# EAGLE design BSB_ESP (EAGLE 9.6.2)
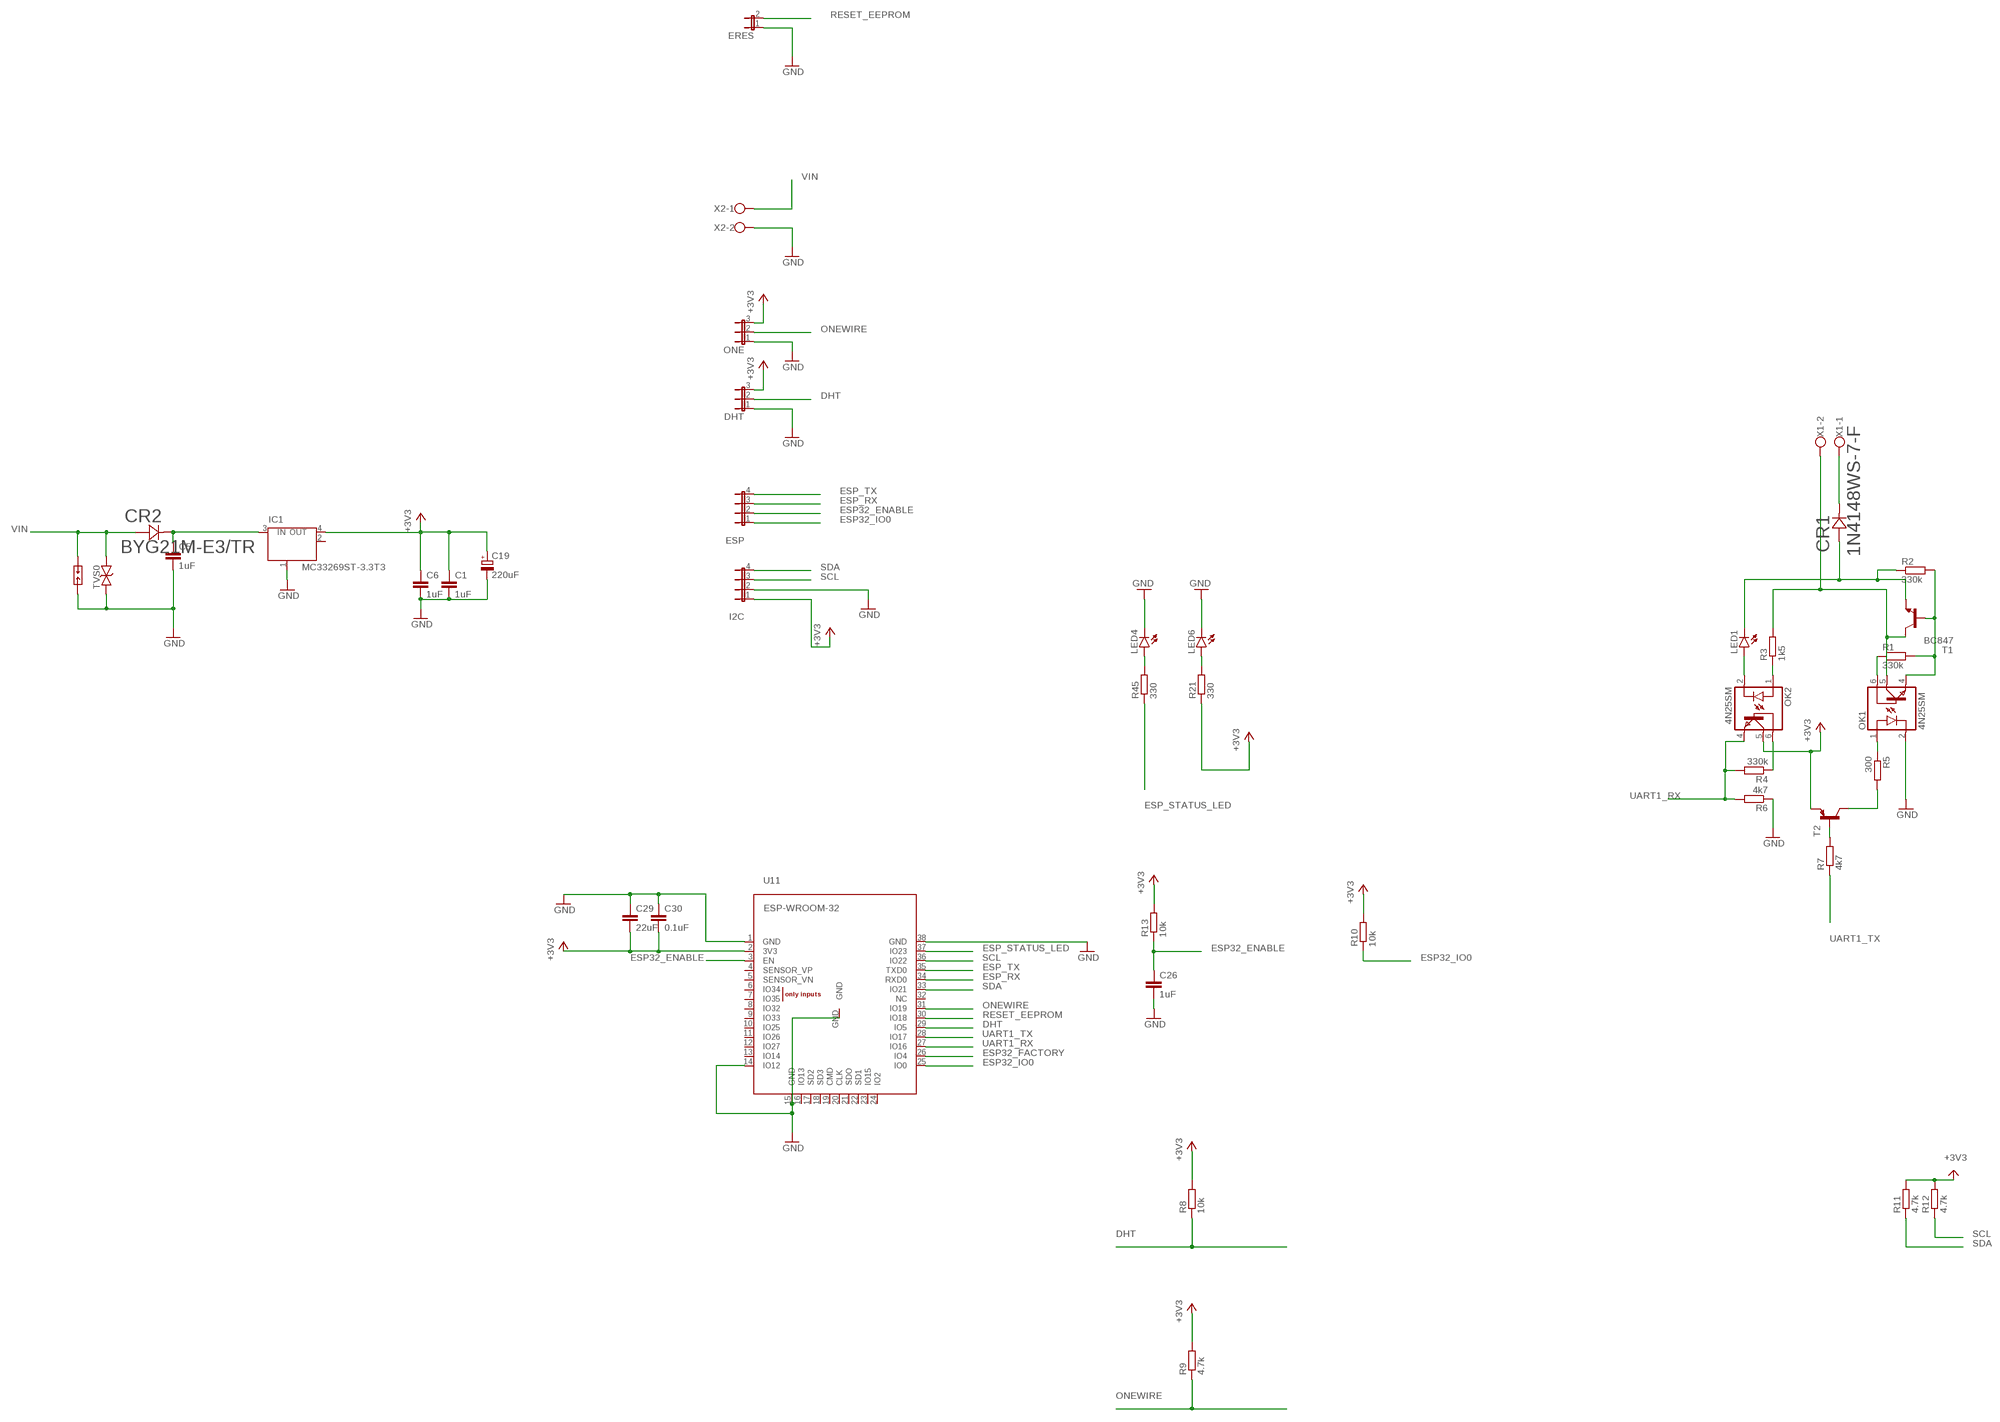
[diagram p0: schematic, sheet 1]

## Parts
C1  1uF  C-EUC1210  [C1210]
C5  1uF  C-EUC0805  [C0805]
C6  1uF  C-EUC0805  [C0805]
C19  220uF  CPOL-EU153CLV-0807  [153CLV-0807]
C26  1uF  C-EUC0603  [C0603]
C29  22uF  C-EUC0805  [C0805]
C30  0.1uF  C-EUC0805  [C0805]
CR1  1N4148WS-7-F  [SOD323_DIO]
CR2  BYG21M-E3/TR  [DO-214AC_VIS]
DHT  JP2E  [JP2]
ERES  JP1E  [JP1]
ESP  JP4E  [JP4]
I2C  JP4E  [JP4]
IC1  MC33269ST-3.3T3  [SOT223]
LED1  LEDCHIP-LED0805  [CHIP-LED0805]
LED4  LEDCHIP-LED0805  [CHIP-LED0805]
LED6  LEDCHIP-LED0805  [CHIP-LED0805]
OK1  4N25SM  [DIL6-SMD]
OK2  4N25SM  [DIL6-SMD]
ONE  JP2E  [JP2]
R1  330k  R-EU_R0603  [R0603]
R2  330k  R-EU_R0603  [R0603]
R3  1k5  R-EU_R0603  [R0603]
R4  330k  R-EU_R0603  [R0603]
R5  300  R-EU_R0603  [R0603]
R6  4k7  R-EU_R0603  [R0603]
R7  4k7  R-EU_R0603  [R0603]
R8  10k  R-EU_R0402  [R0402]
R9  4.7k  R-EU_R0402  [R0402]
R10  10k  R-EU_R0603  [R0603]
R11  4.7k  R-EU_R0603  [R0603]
R12  4.7k  R-EU_R0603  [R0603]
R13  10k  R-EU_R0603  [R0603]
R21  330  R-EU_R0603  [R0603]
R45  330  R-EU_R0603  [R0603]
SP0  PCB-SGAP  [PCB-SGAP]
T1  BC847  [SOT23]
T2  BC857A-PNP-SOT23-BEC  [SOT23-BEC]
TVS0  43CA  DIODE-BTVSSMB  [SMB]
U11  ESP-WROOM-32  [ESP-WROOM-32]
X1  W237-102  [W237-102]
X2  W237-102  [W237-102]

## Nets
+3V3 [3v]: C1.1 C6.1 C19.+ C29.2 C30.2 DHT.3 I2C.1 IC1.4(OUT) OK2.5(COL) ONE.3 R8.2 R9.2 R10.2 R11.2 R12.2 R13.2 R21.1 T2.E U11.2(3V3) ; supply symbol labelled 3.3V
DHT: DHT.2 R8.1 U11.29(IO5)
ESP32_ENABLE: C26.1 ESP.2 R13.1 U11.3(EN)
ESP32_FACTORY: U11.26(IO4)
ESP32_IO0: ESP.1 R10.1 U11.25(IO0)
ESP_RX: ESP.3 U11.34(RXD0)
ESP_STATUS_LED: R45.1 U11.37(IO23)
ESP_TX: ESP.4 U11.35(TXD0)
GND [GND]: C1.2 C5.2 C6.2 C19.- C26.2 C29.1 C30.1 DHT.1 ERES.1 I2C.2 IC1.1(GND/ADJ) LED4.C LED6.C OK1.2(C) ONE.1 R6.1 SP0.2 TVS0.A U11.1(GND) U11.14(IO12) U11.15(GND) U11.38(GND) U11.GND X2.2
N$1: CR1.1 X1.1
N$2: OK2.1(A) R3.1
N$3: LED1.A OK2.2(C)
N$4: OK1.5(COL) R3.2 T1.3(C) X1.2
N$5: OK1.6(BAS) R1.1
N$6: OK1.4(EMI) R1.2 R2.2 T1.1(B)
N$7: CR1.2 LED1.C R2.1 T1.2(E)
N$8: OK2.6(BAS) R4.1
N$9: R7.2 T2.B
N$10: OK1.1(A) R5.1
N$11: R5.2 T2.C
N$35: LED4.A R45.2
N$39: LED6.A R21.2
ONEWIRE: ONE.2 R9.1 U11.31(IO19)
RESET_EEPROM: ERES.2 U11.30(IO18)
SCL: I2C.3 R12.1 U11.36(IO22)
SDA: I2C.4 R11.1 U11.33(IO21)
UART1_RX: OK2.4(EMI) R4.2 R6.2 U11.27(IO16)
UART1_TX: R7.1 U11.28(IO17)
VIN: CR2.2 SP0.1 TVS0.C X2.1
VIN_POS: C5.1 CR2.1 IC1.3(IN)
Unconnected: IC1.2(OUT) U11.4(SENSOR_VP) U11.5(SENSOR_VN) U11.6(IO34) U11.7(IO35) U11.8(IO32) U11.9(IO33) U11.10(IO25) U11.11(IO26) U11.12(IO27) U11.13(IO14) U11.16(IO13) U11.17(SD2) U11.18(SD3) U11.19(CMD) U11.20(CLK) U11.21(SDO) U11.22(SD1) U11.23(IO15) U11.24(IO2) U11.32(NC)

## Library data of the parts
C1 C5 C6 C26 C29 C30 = rcl:C-EU: CAPACITOR, European symbol; SPICEPREFIX: C
C19 = rcl:CPOL-EU: POLARIZED CAPACITOR, European symbol; SPICEPREFIX: C
CR1 = 1N4148WS:1N4148WS-7-F; COPYRIGHT: Copyright (C) 2021 Ultra Librarian. All rights reserved.; MANUFACTURER_PART_NUMBER: 1N4148WS-7-F; MFR_NAME: Diodes Inc
CR2 = BYG21M_E3:BYG21M-E3/TR; COPYRIGHT: Copyright (C) 2021 Ultra Librarian. All rights reserved.; MANUFACTURER_PART_NUMBER: BYG21M-E3/TR; MFR_NAME: Vishay
DHT ONE = jumper:JP2E: JUMPER
ERES = jumper:JP1E: JUMPER
ESP I2C = jumper:JP4E: JUMPER
IC1 = linear:MC33269ST*: Adjustable Output Low Dropout Voltage Regulator 800 mA Source: http://www.onsemi.com/pub/Collateral/MC33269-D.PDF
LED1 LED4 LED6 = led:LED: LED OSRAM: - CHIPLED LG R971, LG N971, LY N971, LG Q971, LY Q971, LO R971, LY R971 LH N974, LH R974 LS Q976, LO Q976, LY Q976 LO Q996 - Hyper CHIPLED LW Q18S LB Q993, LB Q99A, LB R99A - SideLED LS A670, LO A670, LY A670, LG A670, LP A670 LB A673, LV A673, LT A673, LW A673 LH A674 LY A675 LS A676, LA A676, LO A676, LY A676, LW A676 LS A679, LY A679, LG A679 - Hyper Micro SIDELED® LS Y876, LA Y876, LO Y876, LY Y876 LT Y87S - SmartLED LW L88C, LW L88S LB L89C, LB L89S, LG L890 LS L89K, LO L89K, LY L89K LS L896, LA L896, LO L896, LY L896 - TOPLED LS T670, LO T670, LY T670, LG T670, LP T670 LSG T670, LSP T670, LSY T670, LOP T670, LYG T670 LG T671, LOG T671, LSG T671 LB T673, LV T673, LT T673, LW T673 LH T674 LS T676, LA T676, LO T676, LY T676, LB T676, LH T676, LSB T676, LW T676 LB T67C, LV T67C, LT T67C, LS T67K, LO T67K, LY T67K, LW E67C LS E67B, LA E67B, LO E67B, LY E67B, LB E67C, LV E67C, LT E67C LW T67C LS T679, LY T679, LG T679 LS T770, LO T770, LY T770, LG T770, LP T770 LB T773, LV T773, LT T773, LW T773 LH T774 LS E675, LA E675, LY E675, LS T675 LS T776, LA T776, LO T776, LY T776, LB T776 LHGB T686 LT T68C, LB T68C - Hyper Mini TOPLED® LB M676 - Mini TOPLED Santana® LG M470 LS M47K, LO M47K, LY M47K Source: http://www.osram.convergy.de LUXEON: - LUMILED® LXK2-PW12-R00, LXK2-PW12-S00, LXK2-PW14-U00, LXK2-PW14-V00 LXK2-PM12-R00, LXK2-PM12-S00, LXK2-PM14-U00 LXK2-PE12-Q00, LXK2-PE12-R00, LXK2-PE12-S00, LXK2-PE14-T00, LXK2-PE14-U00 LXK2-PB12-K00, LXK2-PB12-L00, LXK2-PB12-M00, LXK2-PB14-N00, LXK2-PB14-P00, LXK2-PB14-Q00 LXK2-PR12-L00, LXK2-PR12-M00, LXK2-PR14-Q00, LXK2-PR14-R00 LXK2-PD12-Q00, LXK2-PD12-R00, LXK2-PD12-S00 LXK2-PH12-R00, LXK2-PH12-S00 LXK2-PL12-P00, LXK2-PL12-Q00, LXK2-PL12-R00 Source: www.luxeon.com KINGBRIGHT: KA-3528ASYC Source: www.kingbright.com
OK1 OK2 = optocoupler:4N*?M: General Purpose 6-Pin Phototransistor Optocouplers Source: http://www.fairchildsemi.com/ds/4N/4N35-M.pdf; MF: FAIRCHILD SEMICONDUCTOR; MPN: 4N25SM; OC_FARNELL: 1021152; OC_NEWARK: 34C2020
R1-R13 R21 R45 = rcl:R-EU_: RESISTOR, European symbol; SPICEPREFIX: R
SP0 = varistor:PCB-SGAP
T1 = transistor:BC847: NPN TRANSISTOR
T2 = transistor:*-PNP-: PNP Transistror
TVS0 = diode:DIODE-BTVS
U11 = esp32b:ESP-WROOM-32
X1 X2 = con-wago-500:W237-102: WAGO SCREW CLAMP; MPN: 237-102; OC_FARNELL: unknown; OC_NEWARK: 70K9898

## Net classes
0 default: width 0.305 mm
4 3v: width 0.508 mm
8 GND: width 0.508 mm

## Board
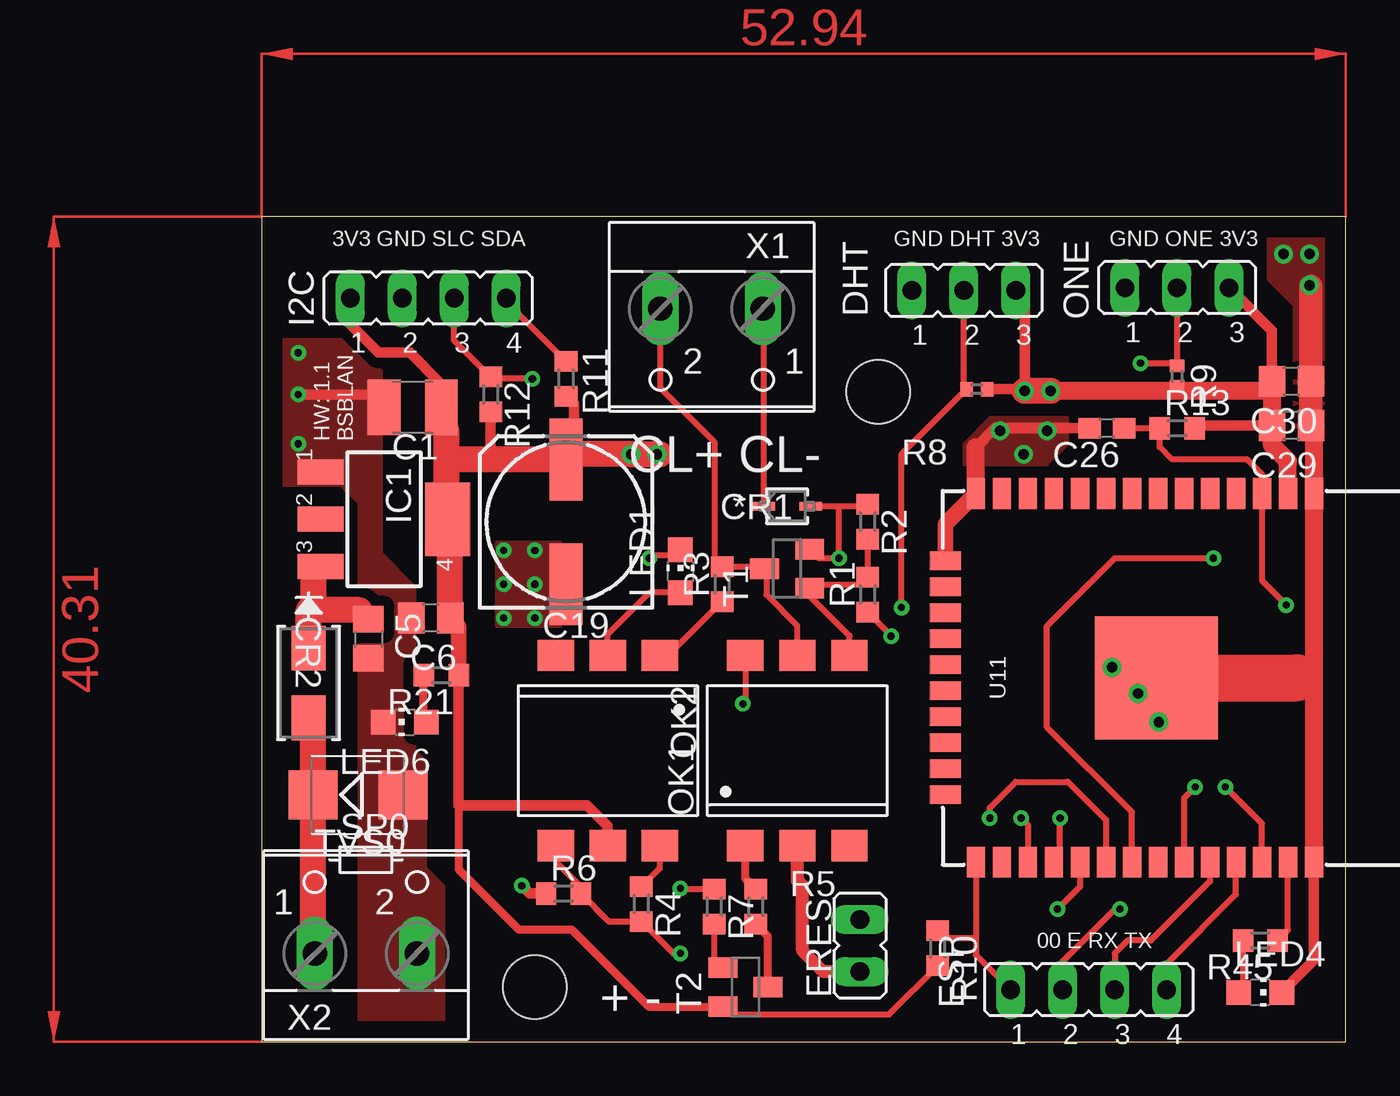
[diagram p1: board, top side]
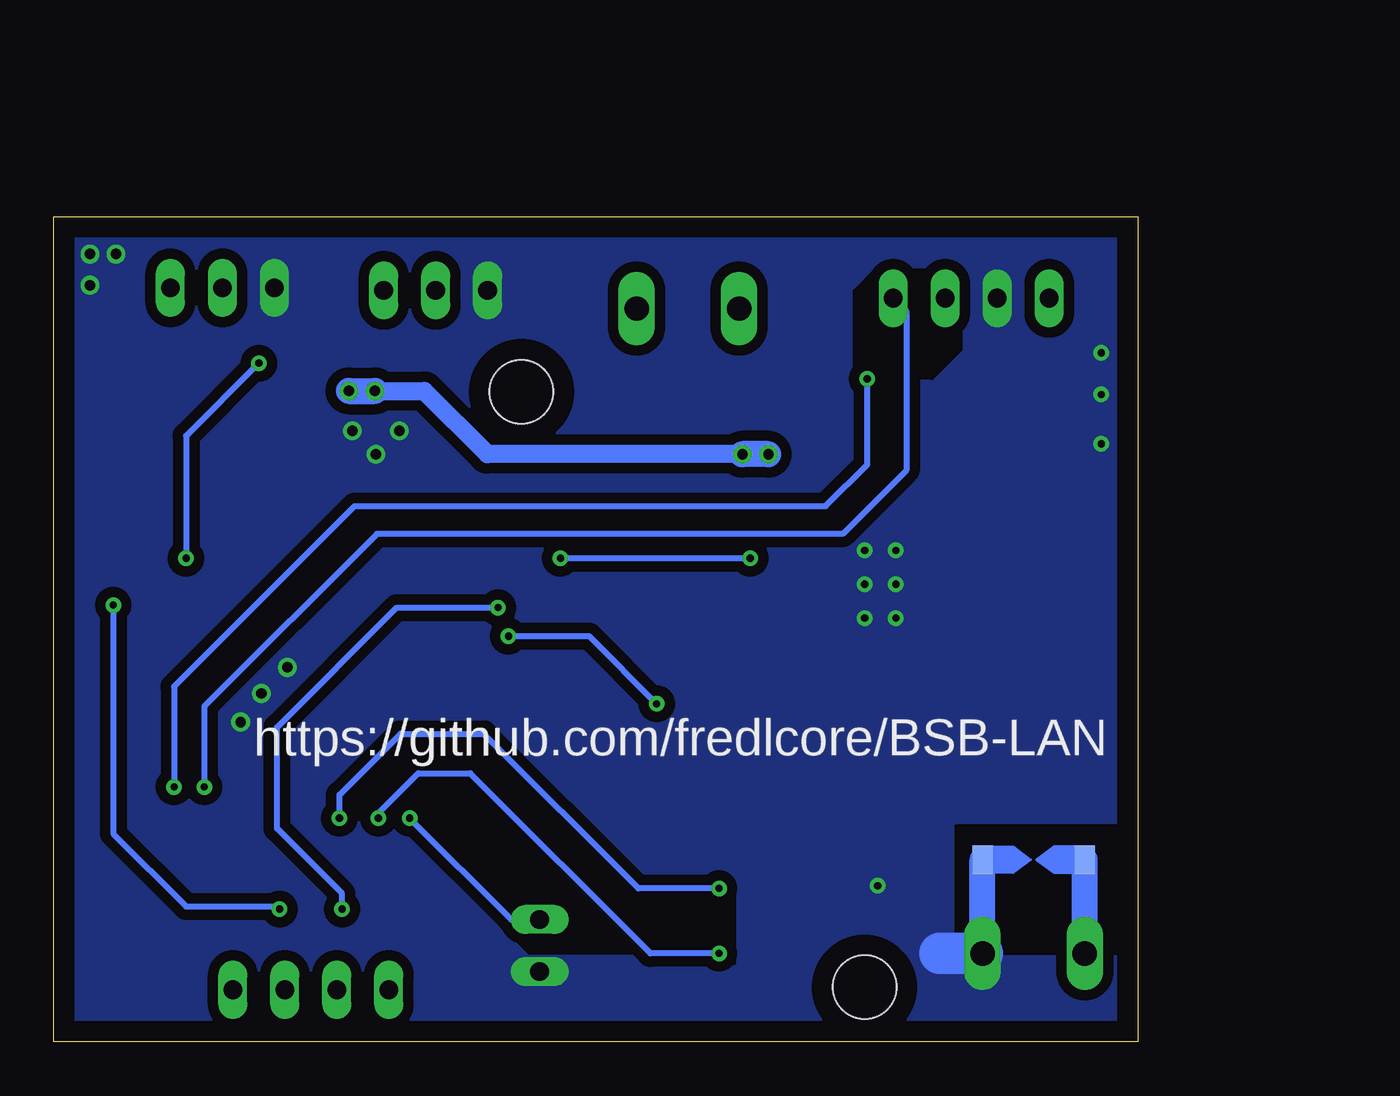
[diagram p2: board, bottom side, seen from below]

Size 52.94 x 40.31 mm. Coordinates in mm from the lower left corner, seen from the top.
Outline: 0,0 52.94,0 52.94,40.31 0,40.31 0,0
Copper layers (1*16): Top 0.035mm / dielectric 1.5mm / Bottom 0.035mm
Design rules "default": minimum track width 6mil, minimum drill 0.35mm, track to track 6mil, track to pad 6mil, pad to pad 6mil, via to via 6mil, smd to smd 6mil, copper to edge 40mil, drill to drill 6mil, minimum pad ring 10mil, minimum via ring 8mil, stop-mask expansion 4mil, vias tented up to drill 0mil, thermal gap 10mil
Holes 3.1 mm at 30.1,31.75 13.34,2.67

### Footprints (pad centres in the part's own frame; a part is rotated, then mirrored left to right if it is on the bottom)
C1210 = smd 1.6 x 2.7: 1 -1.4,0; 2 1.4,0
C0805 = smd 1.3 x 1.5: 1 -0.95,0; 2 0.95,0
153CLV-0807 = smd 4 x 1.6: + 3.05,0; - -3.05,0
C0603 = smd 1.1 x 1: 1 -0.85,0; 2 0.85,0
SOD323_DIO = smd 1.111 x 0.401: 1 -1.15,0; 2 1.15,0
DO-214AC_VIS = smd 2.184 x 1.651: 1 -1.702,0; 2 1.702,0
JP2 = drill 0.914 long: 1 -2.54,0; 2 0,0; 3 2.54,0
JP1 = drill 0.914 long: 1 0,-1.27; 2 0,1.27
JP4 = drill 0.914 long: 1 -3.81,0; 2 -1.27,0; 3 1.27,0; 4 3.81,0
SOT223 = smd 1.219 x 2.235: 1 -2.311,-3.099; 2 0,-3.099; 3 2.311,-3.099 | smd 3.6 x 2.2: 4 0,3.099
CHIP-LED0805 = smd 1.2 x 1.2: A 0,-1.05; C 0,1.05
DIL6-SMD = smd 1.78 x 1.52: 1 -2.54,-4.645; 2 0,-4.645; 3 2.54,-4.645; 4 2.54,4.645; 5 0,4.645; 6 -2.54,4.645
R0603 = smd 1 x 1.1: 1 -0.85,0; 2 0.85,0
R0402 = smd 0.6 x 0.7: 1 -0.5,0; 2 0.5,0
PCB-SGAP = smd 1 x 1.4 bottom: 1 -2.5,0; 2 2.5,0
SOT23 = smd 1 x 1.4: 1 -0.95,-1.1; 2 0.95,-1.1; 3 0,1.1
SOT23-BEC = smd 1 x 1.4: B -0.95,-1.1; C 0,1.1; E 0.95,-1.1
SMB = smd 2.4 x 2.4: A 2.2,0; C -2.2,0
ESP-WROOM-32 = smd 0.9 x 1.5: 1 7.7,9; 2 6.43,9; 3 5.16,9; 4 3.89,9; 5 2.62,9; 6 1.35,9; 7 0.08,9; 8 -1.19,9; 9 -2.46,9; 10 -3.73,9; 11 -5,9; 12 -6.27,9; 13 -7.54,9; 14 -8.81,9; 25 -8.81,-9; 26 -7.54,-9; 27 -6.27,-9; 28 -5,-9; 29 -3.73,-9; 30 -2.46,-9; 31 -1.19,-9; 32 0.08,-9; 33 1.35,-9; 34 2.62,-9; 35 3.89,-9; 36 5.16,-9; 37 6.43,-9; 38 7.7,-9 | smd 1.5 x 0.9: 15 -10.3,5.715; 16 -10.3,4.445; 17 -10.3,3.175; 18 -10.3,1.905; 19 -10.3,0.635; 20 -10.3,-0.635; 21 -10.3,-1.905; 22 -10.3,-3.175; 23 -10.3,-4.445; 24 -10.3,-5.715 | smd 6 x 6: GND 0,0
W237-102 = drill 1.194 long: 1 -2.5,-1.27; 2 2.5,-1.27

### Placement (x,y rotation side)
C1  7.37,30.99 180 top
C5  5.21,19.68 270 top
C6  8.26,20.7 180 top
C19  14.86,25.4 90 top
C26  41.27,29.97 180 top
C29  50.29,30.1 180 top
C30  50.29,32.26 180 top
CR1  25.65,26.16 0 top
CR2  2.29,17.53 270 top
DHT  34.29,36.7 0 top
ERES  29.21,4.7 0 top
ESP  40.39,2.54 0 top
I2C  8.13,36.32 0 top
IC1  5.97,25.53 270 top
LED1  20.45,22.99 0 top
LED4  48.77,2.41 270 top
LED6  6.99,15.62 90 top
OK1  26.16,14.22 0 top
OK2  16.89,14.22 180 top
ONE  44.7,36.83 0 top
R1  29.59,21.84 90 top
R2  29.59,25.4 270 top
R3  22.48,22.35 90 top
R4  18.54,6.73 270 top
R5  24.13,6.6 270 top
R6  14.73,7.24 0 top
R7  22.1,6.6 270 top
R8  34.92,31.88 0 top
R9  44.7,32.51 270 top
R10  33.02,4.57 270 top
R11  14.86,32.38 270 top
R12  11.18,31.62 270 top
R13  44.7,29.97 0 top
R21  8.76,17.91 180 top
R45  48.77,4.95 180 top
SP0  5.08,8.89 0 top
T1  25.65,23.11 90 top
T2  23.62,2.67 270 top
TVS0  4.7,12.06 0 top
U11  43.69,17.78 0 top
X1  21.97,34.54 180 top
X2  5.08,5.59 0 top

### Tracks (layer width: path | path; a pad name or v marks a point on that pad's centre or on a via)
+3V3  (via drill 0.51)
  Top 0.305: T2.E 22.9,1.34 30.63,1.34 R10.2
  Top 0.381: T2.E 18.91,1.72 15.14,5.49 12.55,5.49 9.61,8.42 9.61,11.56
  Top 0.508: ONE.3 49.34,34.73 C30.2 48.87,31.79 | 50.12,28.37 50.04,28.45 | R13.2 45.68,30.1 C29.2 | DHT.3 37.26,36.27 v37.26,31.79 37.17,31.88 R8.2 | OK2.5 16.89,10.54 15.88,11.56 9.61,11.56 R21.1 | R9.2 44.48,31.79 44.45,31.79 | IC1.4 9.02,25.57 | 8.77,31.24 C1.1 8.77,32.13 7.24,33.66 5.71,33.66 4.32,35.05 I2C.1 | 9.14,28.45 9.02,28.57 | 9.02,29.84 8.77,30.1 | R11.2 15.24,31.15 15.24,28.83 C19.+ | R12.2 11.18,28.45
  Top 0.762: 9.46,20.45 C6.1 9.61,20.29 R21.1
  Top 0.889: U11.2 50.12,28.37 | 50.04,28.45 49.34,29.14 C29.2 C30.2 | 48.87,31.79 44.45,31.79 v38.53,31.79 | 8.77,30.1 C1.1 | 15.2,28.7 C19.+
  Top 1.016: 9.21,25.39 IC1.4
  Top 1.27: C6.1 9.21,25.39 | v38.53,31.79 v37.26,31.79 | 9.02,25.57 9.02,28.57 9.02,29.84 | 15.2,28.7 v18.03,28.7 19.43,28.7 | C19.+ 11.18,28.45 9.14,28.45
  Bottom 0.889: v37.26,31.79 34.85,31.79 31.76,28.7 v19.3,28.7
  Bottom 1.27: v38.53,31.79 v37.26,31.79 | v18.03,28.7 v19.3,28.7
DHT  (via drill 0.35)
  Top 0.305: v38.86,6.48 39.96,7.57 U11.29 | v31.24,21.21 31.24,28.7 34.29,31.75 | 34.29,31.75 DHT.2 | R8.1 34.3,31.75 34.29,31.75
  Bottom 0.305: v38.86,6.48 38.86,7.24 42.04,10.41 42.04,15.37 36.2,21.21 v31.24,21.21
ESP32_ENABLE  (via drill 0.35)
  Top 0.305: C26.1 R13.1 43.85,29.04 44.45,28.45 48.13,28.45 48.85,27.73 U11.3 48.85,22.53 v50.04,21.34 | v41.91,6.48 41.66,6.48 39.12,3.94 ESP.2
  Bottom 0.305: v50.04,21.34 50.04,10.16 46.48,6.6 41.91,6.6 v41.91,6.48 | 39.12,2.67 ESP.2
ESP32_IO0
  Top 0.305: U11.25 34.88,5.08 | 34.88,5.08 34.88,4.24 ESP.1 | R10.1 33.36,5.08 34.88,5.08
ESP_RX
  Top 0.305: U11.34 46.31,7.83 43.43,4.95 42.29,4.95 41.66,4.32 ESP.3
ESP_STATUS_LED
  Top 0.305: R45.1 50.12,5.45 U11.37
ESP_TX
  Top 0.305: ESP.4 44.2,3.81 47.58,7.19 U11.35
GND  (via drill 0.35, 0.51)
  Top 0.508: 34.88,29.04 35.81,29.97 C26.2 | 50.55,17.78 51.39,16.94 U11.38 51.39,3.98 LED4.C | R6.1 13.08,7.24 v12.7,7.62 | C1.2 5.33,31.62 v1.78,31.62 | 30.27,3.43 ERES.1
  Top 0.635: ERES.1 27.43,3.43 26.42,4.45 26.42,7.62 26.16,7.87 OK1.2
  Top 0.762: U11.15 33.39,25.29 U11.14
  Top 0.889: U11.38 U11.1 51.39,29.95 C29.1 | U11.14 34.88,29.04 | v51.18,36.96 51.24,36.9
  Top 1.143: 51.24,36.9 C30.1 C29.1
  Top 2.286: U11.GND 50.55,17.78
  Bottom 0.508: 9.65,4.32 10.16,3.81
  Bottom 1.27: X2.2 SP0.2
  Bottom 2.032: X2.2 9.65,4.32
  other vias: 38.35,29.84 36.07,29.84 37.21,28.7 49.91,38.48 51.18,38.48 43.81,15.62 42.8,17.02 1.78,33.66 1.78,29.21 41.53,18.29 13.34,20.7 13.34,22.35 11.81,20.7 13.34,24 11.81,22.35 11.81,24
  pour Top: 34.29,28.19 38.35,28.19 39.37,29.21 39.37,30.48 35.56,30.48 34.29,29.21
  pour Top: 50.42,29.84 50.42,35.94 49.15,37.21 49.15,40.51 53.21,40.51 53.21,29.84
  pour Bottom (isolate 0.508, no thermals): -1.27,41.91 -1.27,-2.54 53.34,-2.54 54.61,-1.27 54.61,41.91
  pour Top (isolate 0.508, no thermals): -1.27,-1.27 8.89,-1.27 8.89,7.62 8,8.51 8,13.72 7.49,14.22 7.49,22.23 5.84,23.88 5.84,32.77 4.32,34.29 -1.27,34.29
  pour Top (no thermals): 14.61,24.38 11.43,24.38 11.43,20.32 14.61,20.32
N$1
  Top 0.305: X1.1 24.5,35.78 CR1.1
N$2
  Top 0.305: R3.1 19.85,18.87 OK2.1
N$3
  Top 0.305: LED1.A 18.94,21.94 16.89,19.89 OK2.2
N$4
  Top 0.305: R3.2 22.48,23.33 | OK1.5 26.16,20.32 24.64,21.84 24.64,23.03 T1.3 24.47,23.2 R3.2 | R3.2 22.1,23.58 22.1,29.3 19.47,31.93 X1.2
N$5  (via drill 0.35)
  Top 0.305: OK1.6 23.62,16.64 v23.5,16.51 | v30.73,19.81 30.73,19.85 R1.1
  Bottom 0.305: v23.5,16.51 26.8,19.81 v30.73,19.81
N$6
  Top 0.305: R2.2 R1.2 29.21,22.31 26.9,22.31 T1.1 26.75,21.78 28.7,19.84 OK1.4
N$7  (via drill 0.35)
  Top 0.305: LED1.C 20.16,23.75 19.05,23.75 v18.92,23.62 | 26.82,24 T1.2 27.2,23.62 v28.19,23.62 28.19,26.16 | CR1.2 28.19,26.16 | 28.19,26.16 29.5,26.16 R2.1
  Bottom 0.305: v28.19,23.62 v18.92,23.62
N$8
  Top 0.305: OK2.6 19.43,8.47 R4.1
N$9
  Top 0.305: T2.B 22.1,4.04 R7.2
N$10
  Top 0.381: R5.1 23.62,7.96 OK1.1
N$11
  Top 0.381: T2.C 24.72,5.16 R5.2
N$35
  Top 0.305: R45.2 47.92,2.61 LED4.A
N$39
  Top 0.381: LED6.A 7.91,15.74 R21.2
ONEWIRE  (via drill 0.35)
  Top 0.305: ONE.2 R9.1 44.57,33.15 v42.93,33.15 | v46.48,23.62 41.66,23.62 38.35,20.32 38.35,15.37 42.5,11.22 U11.31
  Bottom 0.305: v46.48,23.62 46.48,29.59 v42.93,33.15
OUT
  cutout Bottom: 19.68,7.62 19.68,3.81 21.59,3.81 21.59,7.62
  cutout Bottom: 24,4.32 29.72,4.32 32.51,7.11 32.51,7.62 25.15,7.62 24,6.48
  cutout Top: 0,27.05 3.81,27.05 4.57,26.29 4.57,-0.51 0,-0.51
  cutout Bottom: 0,10.54 8.89,10.54 8.89,4.32 0,4.32
  cutout Bottom: 13.84,36.7 12.83,37.72 8.64,37.72 8.64,33.78 10.03,32.38 13.84,32.38
RESET_EEPROM  (via drill 0.35)
  Top 0.305: v35.56,10.92 35.56,11.43 36.83,12.7 39.37,12.7 41.23,10.84 U11.30
  Bottom 0.305: ERES.2 30.61,5.97 v35.56,10.92
SCL  (via drill 0.35)
  Top 0.305: U11.36 48.85,10.66 v47.07,12.45 | 9.4,35.69 I2C.3 9.4,34.25 R12.1 11.26,32.38 v13.21,32.38
  Bottom 0.305: v47.07,12.45 47.07,17.35 38.26,26.16 15.24,26.16 13.21,28.19 v13.21,32.38
SDA  (via drill 0.35)
  Top 0.305: v45.59,12.45 45.04,11.89 U11.33 | R11.1 11.94,36.16 I2C.4
  Bottom 0.305: v45.59,12.45 45.59,16.38 37.16,24.82 14.4,24.82 11.3,27.91 11.3,35.69 I2C.4
UART1_RX  (via drill 0.35)
  Top 0.305: 18.16,5.88 R4.2 | OK2.4 14.35,8.82 15.46,7.71 15.46,7.37 R6.2 16.94,5.88 R4.2 | R4.2 20.11,4.32 v20.45,4.32 | v37.08,10.92 37.42,10.59 U11.27
  Bottom 0.305: v20.45,4.32 23.8,4.32 32.6,13.12 35.14,13.12 37.08,11.18 v37.08,10.92
UART1_TX  (via drill 0.35)
  Top 0.305: R7.1 20.49,7.45 v20.45,7.49 | U11.28 38.99,8.78 v38.99,10.92
  Bottom 0.305: v20.45,7.49 24.38,7.49 31.94,15.05 36.01,15.05 38.99,12.06 v38.99,10.92
VIN
  Top 0.762: X2.1 2.5,4.4 | 2.5,15.61 CR2.2
  Top 1.27: 2.5,4.4 TVS0.C 2.5,15.61
  Bottom 1.27: X2.1 SP0.1
VIN_POS
  Top 0.762: 2.54,22.89 IC1.3 | C5.1 4.76,21.08 | 2.67,21.08 2.54,21.08 2.29,21.08
  Top 1.27: CR2.1 2.29,21.08 | 2.54,21.08 2.54,22.89 | 4.76,21.08 2.67,21.08
(copper drawn outside any net)
  shapes: Top area x2

### Text on the board
bPlace: https://github.com/fredlcore/BSB-LAN
tNames: 3V3 GND SLC SDA | GND DHT 3V3 | GND ONE 3V3 | HW: 1.1 / BSBLAN | CL+ CL- | 00 E RX TX | + -